# EAGLE design IoTSensorSchematic (EAGLE 9.0.0)
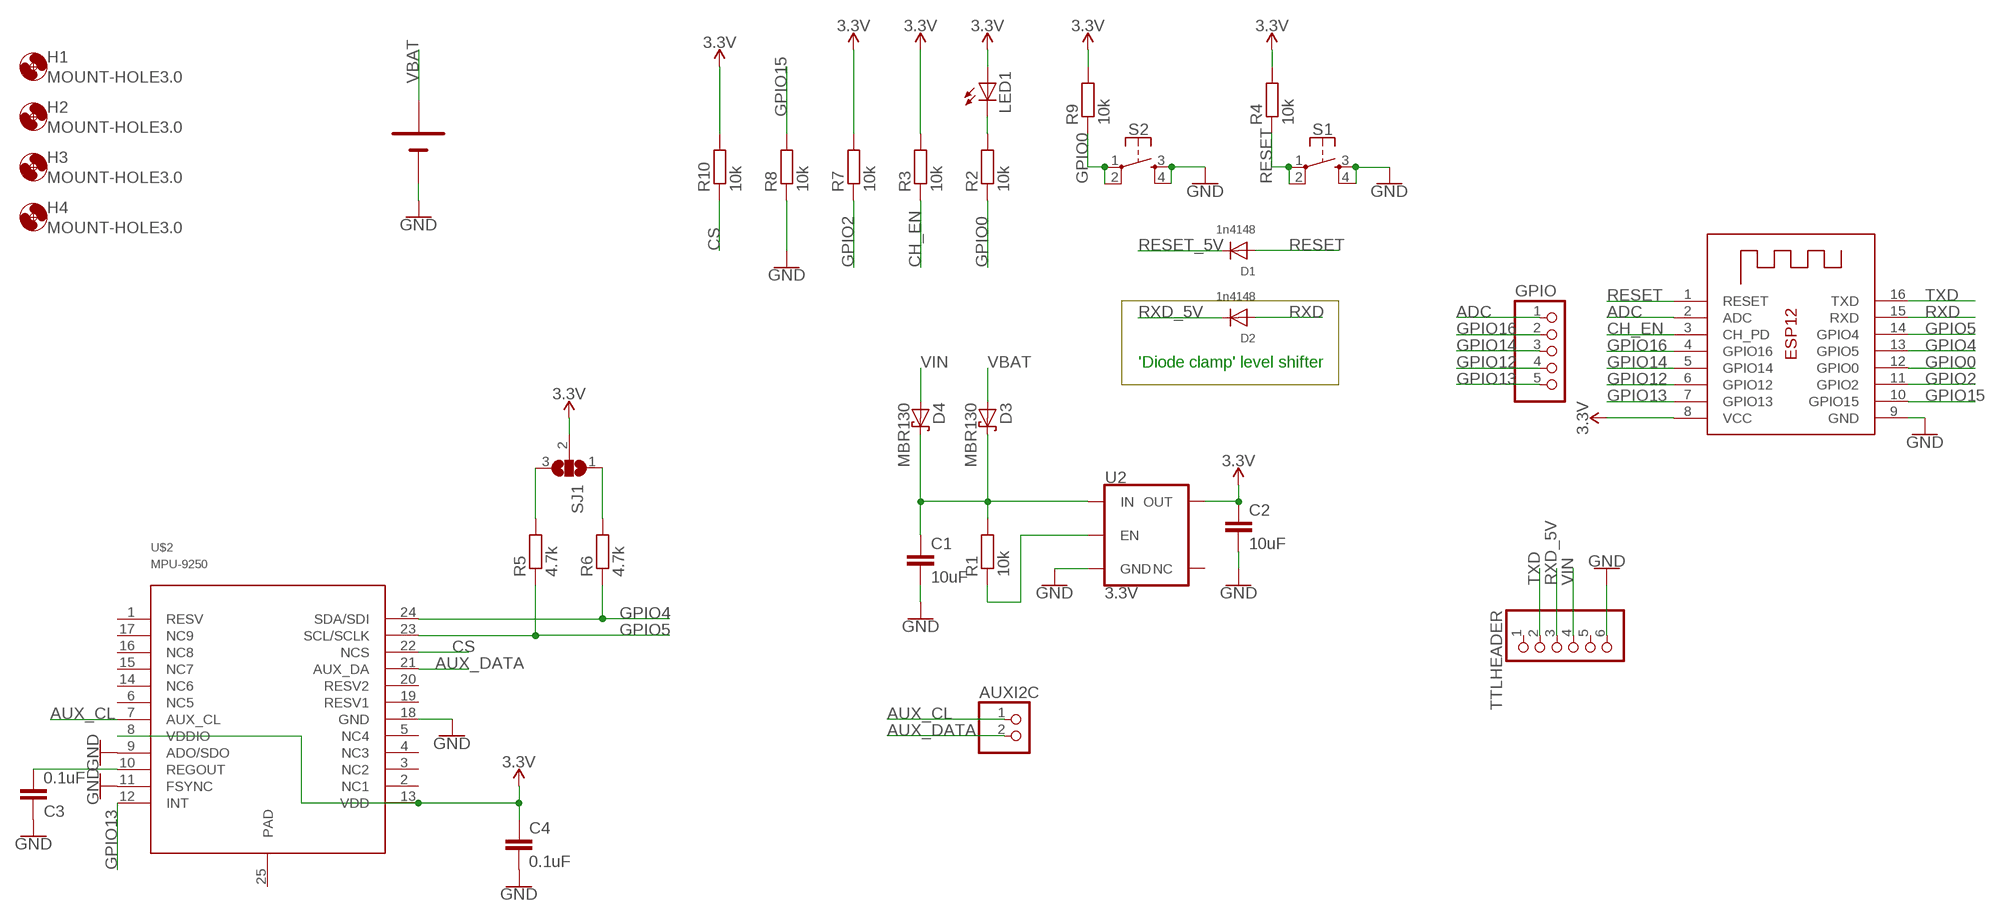
[diagram p0: schematic, sheet 1]

## Parts
AUXI2C  PINHD-1X2  [1X02]
C1  10uF  C-EUC0805  [C0805]
C2  10uF  C-EUC0805  [C0805]
C3  0.1uF  C-EUC0805  [C0805]
C4  0.1uF  C-EUC0805  [C0805]
D1  1n4148  DIODESMA  [SMADIODE]
D2  1n4148  DIODESMA  [SMADIODE]
D3  MBR130  MBRS130LT3  [SMB]
D4  MBR130  MBRS130LT3  [SMB]
GPIO  PINHD-1X5  [1X05]
H1  MOUNT-HOLE3.0  [3,0]
H2  MOUNT-HOLE3.0  [3,0]
H3  MOUNT-HOLE3.0  [3,0]
H4  MOUNT-HOLE3.0  [3,0]
LED1  LEDCHIP-LED0805  [CHIP-LED0805]
R1  10k  R-EU_R0805  [R0805]
R2  10k  R-EU_R0805  [R0805]
R3  10k  R-EU_R0805  [R0805]
R4  10k  R-EU_R0805  [R0805]
R5  4.7k  R-EU_R0805  [R0805]
R6  4.7k  R-EU_R0805  [R0805]
R7  10k  R-EU_R0805  [R0805]
R8  10k  R-EU_R0805  [R0805]
R9  10k  R-EU_R0805  [R0805]
R10  10k  R-EU_R0805  [R0805]
S1  MOMENTARY-SWITCH-SPST-2-SMD-5.2MM  [TACTILE_SWITCH_SMD_5.2MM]
S2  MOMENTARY-SWITCH-SPST-2-SMD-5.2MM  [TACTILE_SWITCH_SMD_5.2MM]
SJ1  SJ2W  [SJ_2]
TTLHEADER  PINHD-1X6  [1X06]
U2  3.3V  V_REG_AP2112K-3.3V  [SOT23-5]
U$1  SMTU_2450N  [SMTU_2450N]
U$2  MPU-9250  [LEAD-QFN24]
X1  ESP-12  [ESP-12]

## Nets
3.3V: C2.1 C4.1 LED1.A R3.2 R4.2 R7.2 R9.2 R10.2 SJ1.2 U2.5(OUT) U$2.8(VDDIO) U$2.13(VDD) X1.8(VCC)
ADC: GPIO.1 X1.2(ADC)
AUX_CL: AUXI2C.1 U$2.7(AUX_CL)
AUX_DATA: AUXI2C.2 U$2.21(AUX_DA)
CH_EN: R3.1 X1.3(CH_PD)
CS: R10.1 U$2.22(NCS)
GND: C1.2 C2.2 C3.1 C4.2 R8.1 S1.3 S1.4 S2.3 S2.4 TTLHEADER.6 U2.2(GND) U$1.P$1(P$1N) U$2.9(ADO/SDO) U$2.11(FSYNC) U$2.18(GND) X1.9(GND)
GPIO0: R2.1 R9.1 S2.1 S2.2 X1.12(GPIO0)
GPIO2: R7.1 X1.11(GPIO2)
GPIO4: R6.1 U$2.24(SDA/SDI) X1.13(GPIO5)
GPIO5: R5.1 U$2.23(SCL/SCLK) X1.14(GPIO4)
GPIO12: GPIO.4 X1.6(GPIO12)
GPIO13: GPIO.5 U$2.12(INT) X1.7(GPIO13)
GPIO14: GPIO.3 X1.5(GPIO14)
GPIO15: R8.2 X1.10(GPIO15)
GPIO16: GPIO.2 X1.4(GPIO16)
N$1: R1.1 U2.3(EN)
N$2: C1.1 D3.C D4.C R1.2 U2.1(IN)
N$3: LED1.C R2.2
N$4: R5.2 SJ1.3
N$5: C3.2 U$2.10(REGOUT)
N$6: R6.2 SJ1.1
RESET: D1.A R4.1 S1.1 S1.2 X1.1(RESET)
RESET_5V: D1.C
RXD: D2.A X1.15(RXD)
RXD_5V: D2.C TTLHEADER.3
TXD: TTLHEADER.2 X1.16(TXD)
VBAT: D3.A U$1.P$2(P$2P)
VIN: D4.A TTLHEADER.4
Unconnected: TTLHEADER.1 TTLHEADER.5 U2.4(NC) U$2.1(RESV) U$2.2(NC1) U$2.3(NC2) U$2.4(NC3) U$2.5(NC4) U$2.6(NC5) U$2.14(NC6) U$2.15(NC7) U$2.16(NC8) U$2.17(NC9) U$2.19(RESV1) U$2.20(RESV2) U$2.25(PAD)

## Notes on the sheet
- 'Diode clamp' level shifter

## Library data of the parts
AUXI2C = pinhead:PINHD-1X2: PIN HEADER
C1-C4 = rcl:C-EU: CAPACITOR, European symbol; SPICEPREFIX: C
D1 D2 = adafruit:DIODE: Diode SMADIODE - SMA Surface Mount Package 20V 1A Schottky Diode Digikey: 641-1014-6-ND DO-1N4148 - Through Hole Small Current Diode SOD-123 20V 1 A (.5mV Vf) Schottky Diode - Digikey: MBRX120TPMSCT-ND SOD-323 10V 570mA (.38mV Vf, 3ns) Schottky Diode - Digikey: ZLLS410CT-ND SOD-523 30V 30mA Schottky Diode (RB751S-40TE61) - Digikey: RB751S-40TE61CT-ND SOT23-R/W - SOT23 Package (R = Solder Paste/Reflow Ovens, W = Hand-Soldering) BAT54Film 40V 300mA - Digikey: 497-7162-1-ND
D3 D4 = diode:MBRS130LT3: Schottky Power Rectifier Source: http://www.onsemi.com/pub/Collateral/MBRS130LT3-D.PDF
GPIO = pinhead:PINHD-1X5: PIN HEADER
H1-H4 = holes:MOUNT-HOLE: MOUNTING HOLE with drill center marker
LED1 = adafruit:LED: LED OSRAM: - CHIPLED LG R971, LG N971, LY N971, LG Q971, LY Q971, LO R971, LY R971 LH N974, LH R974 LS Q976, LO Q976, LY Q976 LO Q996 - Hyper CHIPLED LW Q18S LB Q993, LB Q99A, LB R99A - SideLED LS A670, LO A670, LY A670, LG A670, LP A670 LB A673, LV A673, LT A673, LW A673 LH A674 LY A675 LS A676, LA A676, LO A676, LY A676, LW A676 LS A679, LY A679, LG A679 - Hyper Micro SIDELED® LS Y876, LA Y876, LO Y876, LY Y876 LT Y87S - SmartLED LW L88C, LW L88S LB L89C, LB L89S, LG L890 LS L89K, LO L89K, LY L89K LS L896, LA L896, LO L896, LY L896 - TOPLED LS T670, LO T670, LY T670, LG T670, LP T670 LSG T670, LSP T670, LSY T670, LOP T670, LYG T670 LG T671, LOG T671, LSG T671 LB T673, LV T673, LT T673, LW T673 LH T674 LS T676, LA T676, LO T676, LY T676, LB T676, LH T676, LSB T676, LW T676 LB T67C, LV T67C, LT T67C, LS T67K, LO T67K, LY T67K, LW E67C LS E67B, LA E67B, LO E67B, LY E67B, LB E67C, LV E67C, LT E67C LW T67C LS T679, LY T679, LG T679 LS T770, LO T770, LY T770, LG T770, LP T770 LB T773, LV T773, LT T773, LW T773 LH T774 LS E675, LA E675, LY E675, LS T675 LS T776, LA T776, LO T776, LY T776, LB T776 LHGB T686 LT T68C, LB T68C - Hyper Mini TOPLED® LB M676 - Mini TOPLED Santana® LG M470 LS M47K, LO M47K, LY M47K Source: http://www.osram.convergy.de/
R1-R10 = rcl:R-EU_: RESISTOR, European symbol; SPICEPREFIX: R
S1 S2 = SparkFun-Switches:MOMENTARY-SWITCH-SPST-2: Momentary Switch (Pushbutton) - SPST - Two Circuits Normally-open (NO) SPST momentary switches (buttons, pushbuttons). Schematic symbol includes two switch circuits. Variants SMD-4.6MMX2.8MM - 4.60mm x 2.80mm Tactile Momentary Button Switch - Used on SparkFun SAMD21 Mini Breakout <https://www.sparkfun.com/products/13664> SMD-5.2MM - Mini Pushbutton Switch - SMD <https://www.sparkfun.com/products/8720> - Used on Arduino Pro Mini <https://www.sparkfun.com/products/11114>; PROD_ID: SWCH-08247; SF_SKU: COM-08720
SJ1 = jumper:SJ2W: SMD solder JUMPER
TTLHEADER = pinhead:PINHD-1X6: PIN HEADER
U2 = SparkFun-IC-Power:V_REG_AP2112: AP2112 - 600mA CMOS LDO Regulator w/ Enable The AP2112 is CMOS process low dropout linear regulator with enable function, the regulator delivers a guaranteed 600mA (min.) continuous load current. Features Output Voltage Accuracy: ±1.5% Output Current: 600mA (Min.) Foldback Short Current Protection: 50mA Enable Function to Turn ON/OFF VOUT Low Dropout Voltage (3.3V): 250mV (Typ.) @IOUT=600mA Excellent Load Regulation: 0.2%/A (Typ.) Excellent Line Regulation: 0.02%/V (Typ.) Low Quiescent Current: 55μA (Typ.) Low Standby Current: 0.01μA (Typ.) Low Output Noise: 50μVRMS PSRR: 100Hz -65dB, 1kHz -65dB OTSD Protection Stable with 1.0μF Flexible Cap: Ceramic, Tantalum and Aluminum Electrolytic Operation Temperature Range: -40°C to 85°C ESD: MM 400V, HBM 4000V; PROD_ID: VREG-12457
U$1 = CustomIoTLibrary:SMTU_2450N
U$2 = invensense:MPU-9250
X1 = adafruit:ESP-12

## Board
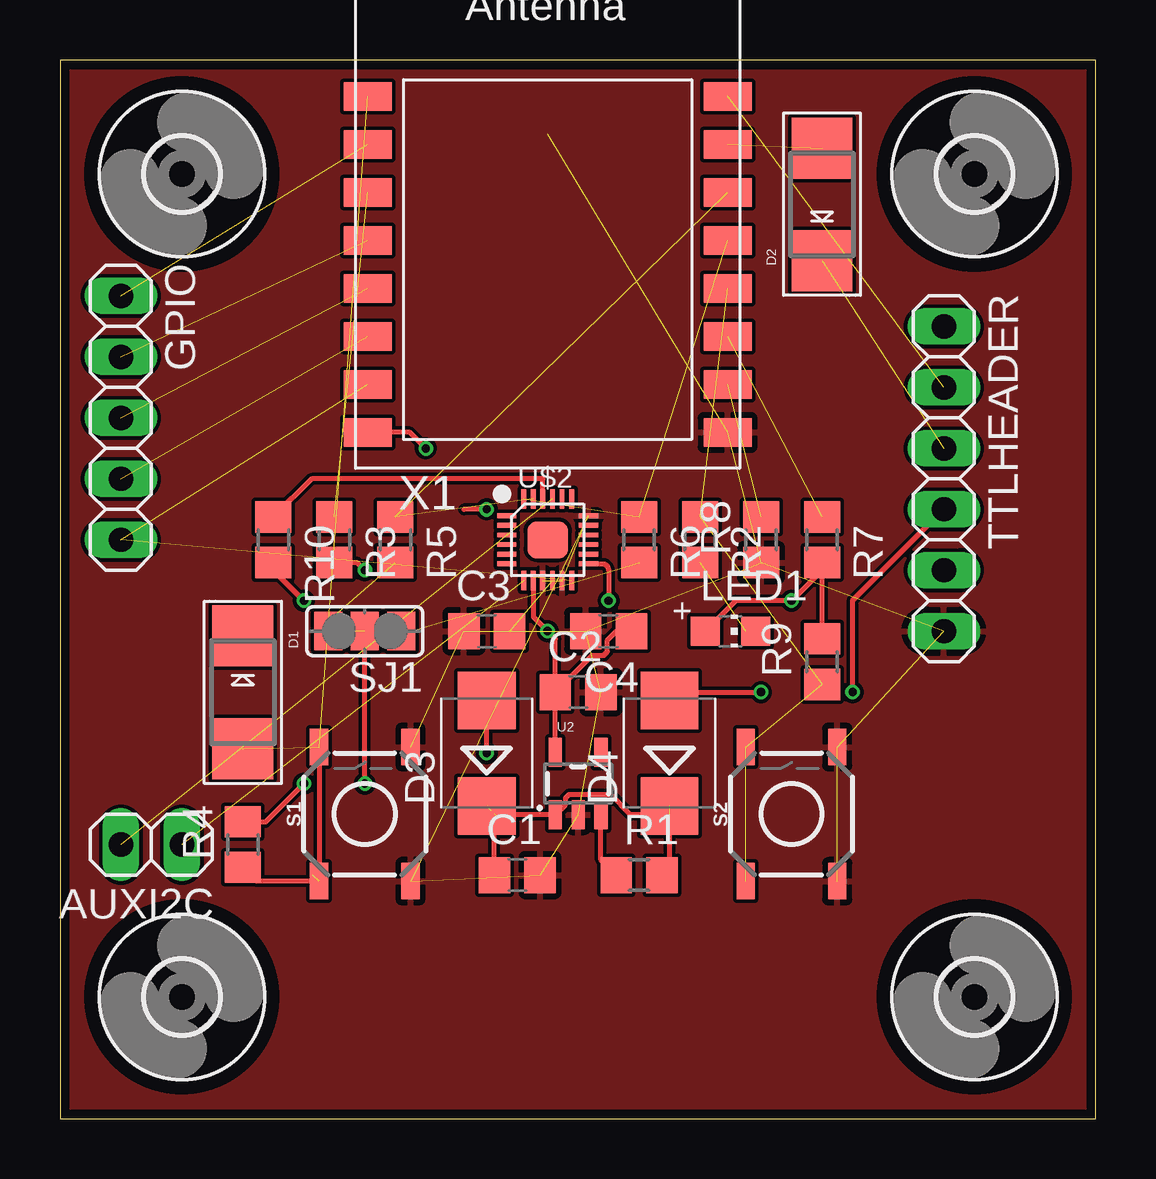
[diagram p1: board, top side]
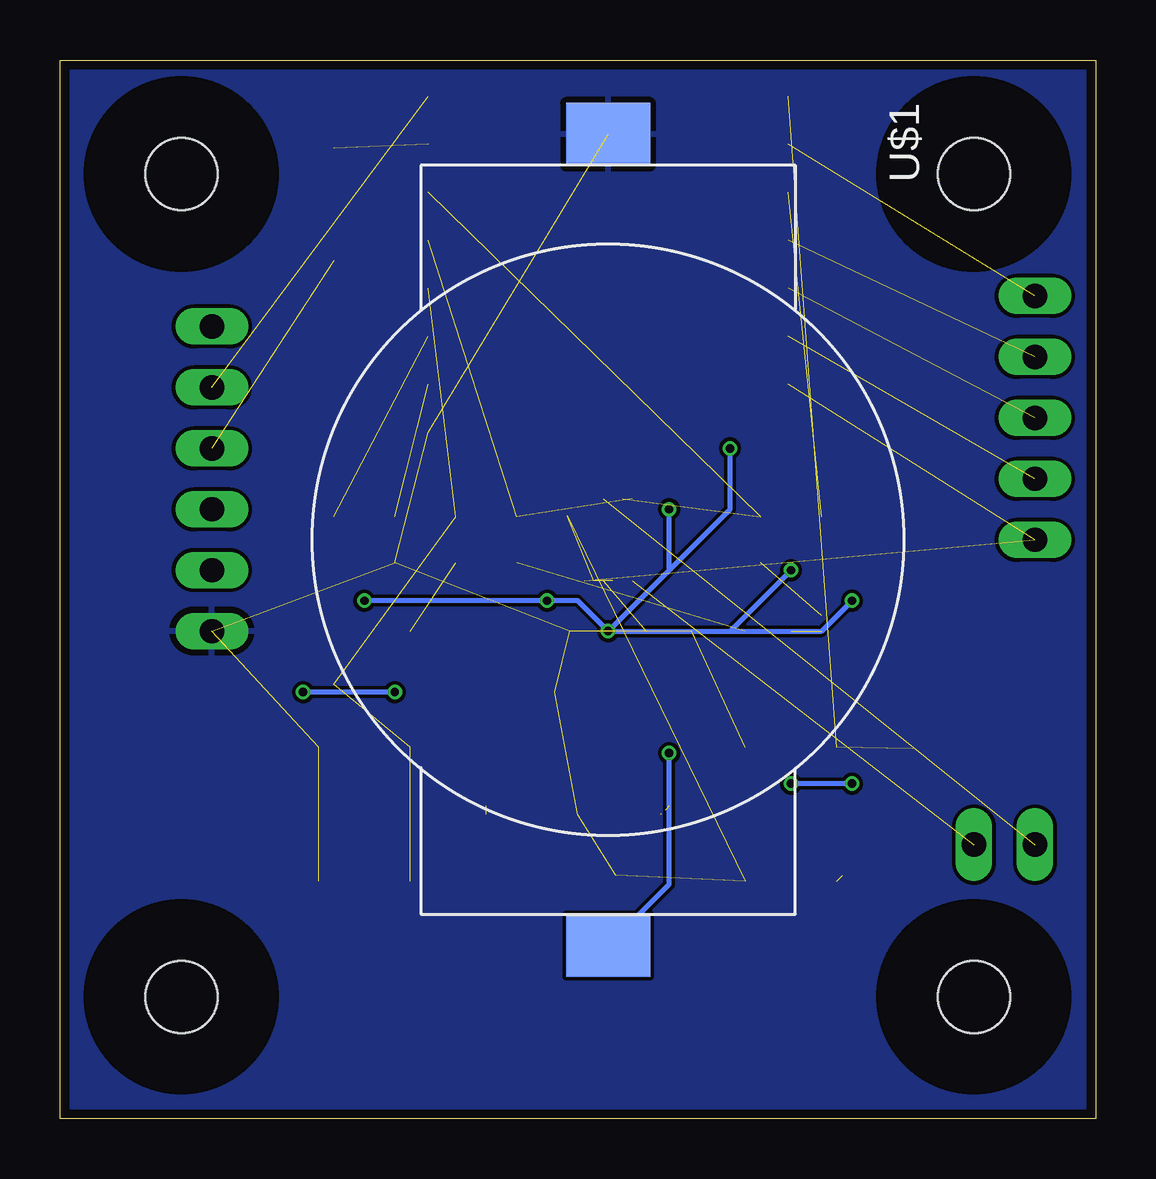
[diagram p2: board, bottom side, seen from below]

Size 43.16 x 44.12 mm. Coordinates in mm from the lower left corner, seen from the top.
Outline: 0,0 43.16,0 43.16,44.12 0,44.12 0,0
Copper layers (1*16): Top 0.035559375mm / dielectric 1.6mm / Bottom 0.035559375mm
Design rules "oshpark-2layer": minimum track width 6mil, minimum drill 10mil, track to track 6mil, track to pad 6mil, pad to pad 6mil, via to via 6mil, smd to smd 6mil, copper to edge 15mil, drill to drill 6mil, minimum pad ring 5mil, minimum via ring 5mil, stop-mask expansion 2.5mil, vias tented up to drill 0mil, thermal gap 10mil

### Footprints (pad centres in the part's own frame; a part is rotated, then mirrored left to right if it is on the bottom)
1X02 = drill 1.016 long: 1 -1.27,0; 2 1.27,0
C0805 = smd 1.3 x 1.5: 1 -0.95,0; 2 0.95,0
SMADIODE = smd 2.54 x 2.54: A 2.349,0; C -2.349,0
SMB = smd 2.4 x 2.4: A 2.2,0; C -2.2,0
1X05 = drill 1.016 long: 1 -5.08,0; 2 -2.54,0; 3 0,0; 4 2.54,0; 5 5.08,0
3,0 = hole 3: 0,0
CHIP-LED0805 = smd 1.2 x 1.2: A 0,-1.05; C 0,1.05
R0805 = smd 1.3 x 1.5: 1 -0.95,0; 2 0.95,0
TACTILE_SWITCH_SMD_5.2MM = smd 1.524 x 0.762: 1 -2.794,1.905; 2 2.794,1.905; 3 -2.794,-1.905; 4 2.794,-1.905
SJ_2 = smd 1.168 x 1.6: 1 -1.524,0; 2 0,0; 3 1.524,0
1X06 = drill 1.016 long: 1 -6.35,0; 2 -3.81,0; 3 -1.27,0; 4 1.27,0; 5 3.81,0; 6 6.35,0
SOT23-5 = smd 0.55 x 1.2: 1 -0.95,-1.3; 2 0,-1.3; 3 0.95,-1.3; 4 0.95,1.3; 5 -0.95,1.3
SMTU_2450N = smd 2.6 x 3.5: P$1 -16.9,0; P$2 16.9,0
LEAD-QFN24 = smd 0.8 x 0.2: 1 -1.7,1; 2 -1.7,0.6; 3 -1.7,0.2; 4 -1.7,-0.2; 5 -1.7,-0.6; 6 -1.7,-1; 13 1.7,-1; 14 1.7,-0.6; 15 1.7,-0.2; 16 1.7,0.2; 17 1.7,0.6; 18 1.7,1 | smd 0.2 x 0.8: 7 -1,-1.7; 8 -0.6,-1.7; 9 -0.2,-1.7; 10 0.2,-1.7; 11 0.6,-1.7; 12 1,-1.7; 19 1,1.7; 20 0.6,1.7; 21 0.2,1.7; 22 -0.2,1.7; 23 -0.6,1.7; 24 -1,1.7 | smd 1.7 x 1.54: 25 0,0
ESP-12 = smd 2 x 1.2: 1 -7.5,4.5; 2 -7.5,2.5; 3 -7.5,0.5; 4 -7.5,-1.5; 5 -7.5,-3.5; 6 -7.5,-5.5; 7 -7.5,-7.5; 8 -7.5,-9.5; 9 7.5,-9.5; 10 7.5,-7.5; 11 7.5,-5.5; 12 7.5,-3.5; 13 7.5,-1.5; 14 7.5,0.5; 15 7.5,2.5; 16 7.5,4.5

### Placement (x,y rotation side)
AUXI2C  3.81,11.43 180 top
C1  19.05,10.16 0 top
C2  21.59,17.78 0 top
C3  17.78,20.32 0 top
C4  22.86,20.32 180 top
D1  7.62,17.78 270 top
D2  31.75,38.1 90 top
D3  17.78,15.24 90 top
D4  25.4,15.24 90 top
GPIO  2.54,29.21 270 top
H1  5.08,39.37 0 top
H2  38.1,39.37 0 top
H3  38.1,5.08 0 top
H4  5.08,5.08 0 top
LED1  27.94,20.32 270 top
R1  24.13,10.16 0 top
R2  26.67,24.13 270 top
R3  11.43,24.13 270 top
R4  7.62,11.43 90 top
R5  13.97,24.13 270 top
R6  24.13,24.13 270 top
R7  31.75,24.13 270 top
R8  29.21,24.13 90 top
R9  31.75,19.05 90 top
R10  8.89,24.13 270 top
S1  12.7,12.7 90 top
S2  30.48,12.7 90 top
SJ1  12.7,20.32 180 top
TTLHEADER  36.83,26.67 270 top
U2  21.59,13.97 0 top
U$1  20.32,24.13 270 bottom
U$2  20.32,24.13 0 top
X1  20.32,38.1 0 top

### Tracks (layer width: path | path; a pad name or v marks a point on that pad's centre or on a via)
3.3V  (via drill 0.35)  (1 unrouted)
  Top 0.2: R4.2 8.57,12.38 v10.16,13.97 | v12.7,13.97 SJ1.2 | R9.2 31.75,22.86 | 31.75,22.86 R7.2 | C4.1 23.18,20.32 22.81,19.95 22.81,19.46 22.66,19.32 22.18,19.32 C2.1 | C2.1 20.64,20 v20.32,20.32 19.72,20.92 U$2.8 | v17.78,25.4 16.83,25.4 | v12.7,22.86 12.38,23.18 R3.2 | v15.24,27.94 14.58,28.6 X1.8 | LED1.A 28.16,21.59 v30.48,21.59 31.75,22.86 | U2.5 C2.1 | v10.16,21.59 8.89,22.86 R10.2 | U$2.13 22.59,23.13 arc-90 22.86,22.86 v22.86,21.59
  Bottom 0.2: v10.16,13.97 v12.7,13.97 | v20.32,20.32 17.78,22.86 v17.78,25.4 | v20.32,20.32 15.24,20.32 v12.7,22.86 | v20.32,20.32 15.24,25.4 v15.24,27.94 | v20.32,20.32 21.59,21.59 v22.86,21.59 v30.48,21.59 | v20.32,20.32 11.43,20.32 v10.16,21.59
ADC  (1 unrouted)
AUX_CL  (1 unrouted)
AUX_DATA  (1 unrouted)
CH_EN  (1 unrouted)
CS
  Top 0.2: U$2.22 20.12,26.67 10.48,26.67 R10.1
GND  (15 unrouted)
  pour Bottom: -1.27,45.72 -1.27,-1.27 44.45,-1.27 44.45,45.72
  pour Top: 0,44.45 0,0 43.18,0 43.18,44.45
GPIO0  (4 unrouted)
GPIO2  (1 unrouted)
GPIO4  (2 unrouted)
GPIO5  (2 unrouted)
GPIO12  (1 unrouted)
GPIO13  (2 unrouted)
GPIO14  (1 unrouted)
GPIO15  (1 unrouted)
GPIO16  (1 unrouted)
N$1
  Top 0.2: R1.1 22.54,10.8 U2.3
N$2  (3 unrouted)
  Top 0.152: 18.15,12.67 17.95,12.87
  Top 0.2: C1.1 18.1,12.72 | 18.15,12.67 U2.1 21.06,13.09 21.06,13.37 21.21,13.52 22.92,13.52 23.74,12.7 25.4,12.7 25.4,10.48 R1.2
N$3  (1 unrouted)
  Top 0.152: 28.57,20.32 LED1.C
N$4  (1 unrouted)
  Top 0.152: 11.43,20.95 11.43,20.32 SJ1.3
N$5  (1 unrouted)
N$6  (1 unrouted)
  Top 0.152: 14.61,20.32 SJ1.1
RESET  (3 unrouted)
  Top 0.152: 7.62,15.88 D1.A
  Top 0.2: S1.2 S1.1 8.19,9.91 R4.1
RXD  (1 unrouted)
RXD_5V  (1 unrouted)
TXD  (1 unrouted)
VBAT  (via drill 0.35)
  Top 0.152: 17.78,17.14 D3.A
  Top 0.2: v17.78,15.24 D3.A
  Bottom 0.152: 19.68,7.62 20.32,7.62 U$1.P$2
  Bottom 0.2: U$1.P$2 17.78,9.77 v17.78,15.24
VIN  (via drill 0.35)
  Top 0.2: D4.A 25.74,17.78 v29.21,17.78 | v33.03,17.78 33.03,21.6 TTLHEADER.4
  Bottom 0.2: v29.21,17.78 v33.03,17.78